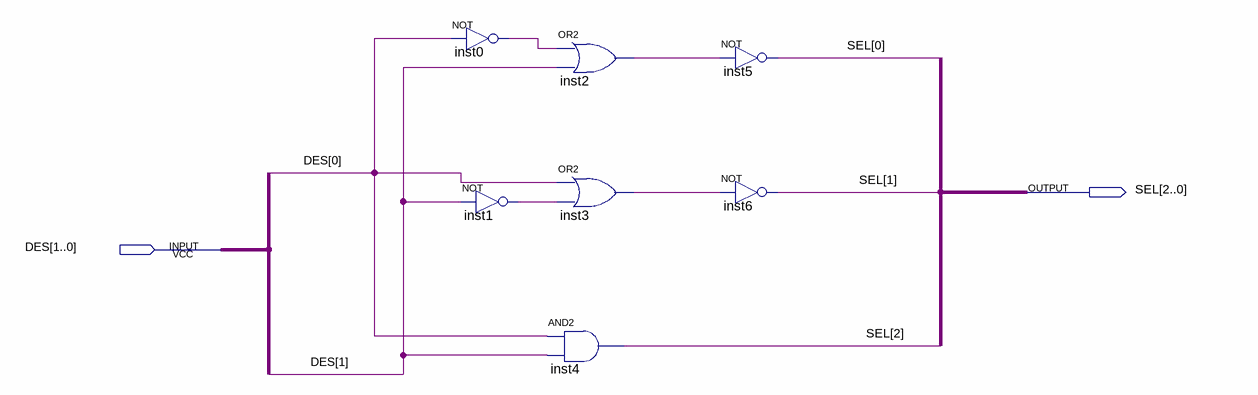
[diagram p0: schematic sheet]
// Quartus schematic DestinationDecoder.bdf as structural Verilog: 7 symbols, 2 pins
module DestinationDecoder (
  input  [1:0] DES,
  output [2:0] SEL
);

  wire inst0_out, inst1_out, inst2_out, inst3_out;

  not inst0 (inst0_out, DES[0]);
  not inst1 (inst1_out, DES[1]);
  or inst2 (inst2_out, inst0_out, DES[1]);
  or inst3 (inst3_out, DES[0], inst1_out);
  and inst4 (SEL[2], DES[0], DES[1]);
  not inst5 (SEL[0], inst2_out);
  not inst6 (SEL[1], inst3_out);
endmodule
